# Altium schematic sheet Test1.SchDoc: EBM-A7157
size A4; CheckedBy: Colin Zhang; Author: Colin Zhang; CompanyName: Hisense; DrawnBy: Colin Zhang; Engineer: Colin Zhang; Organization: Hisense
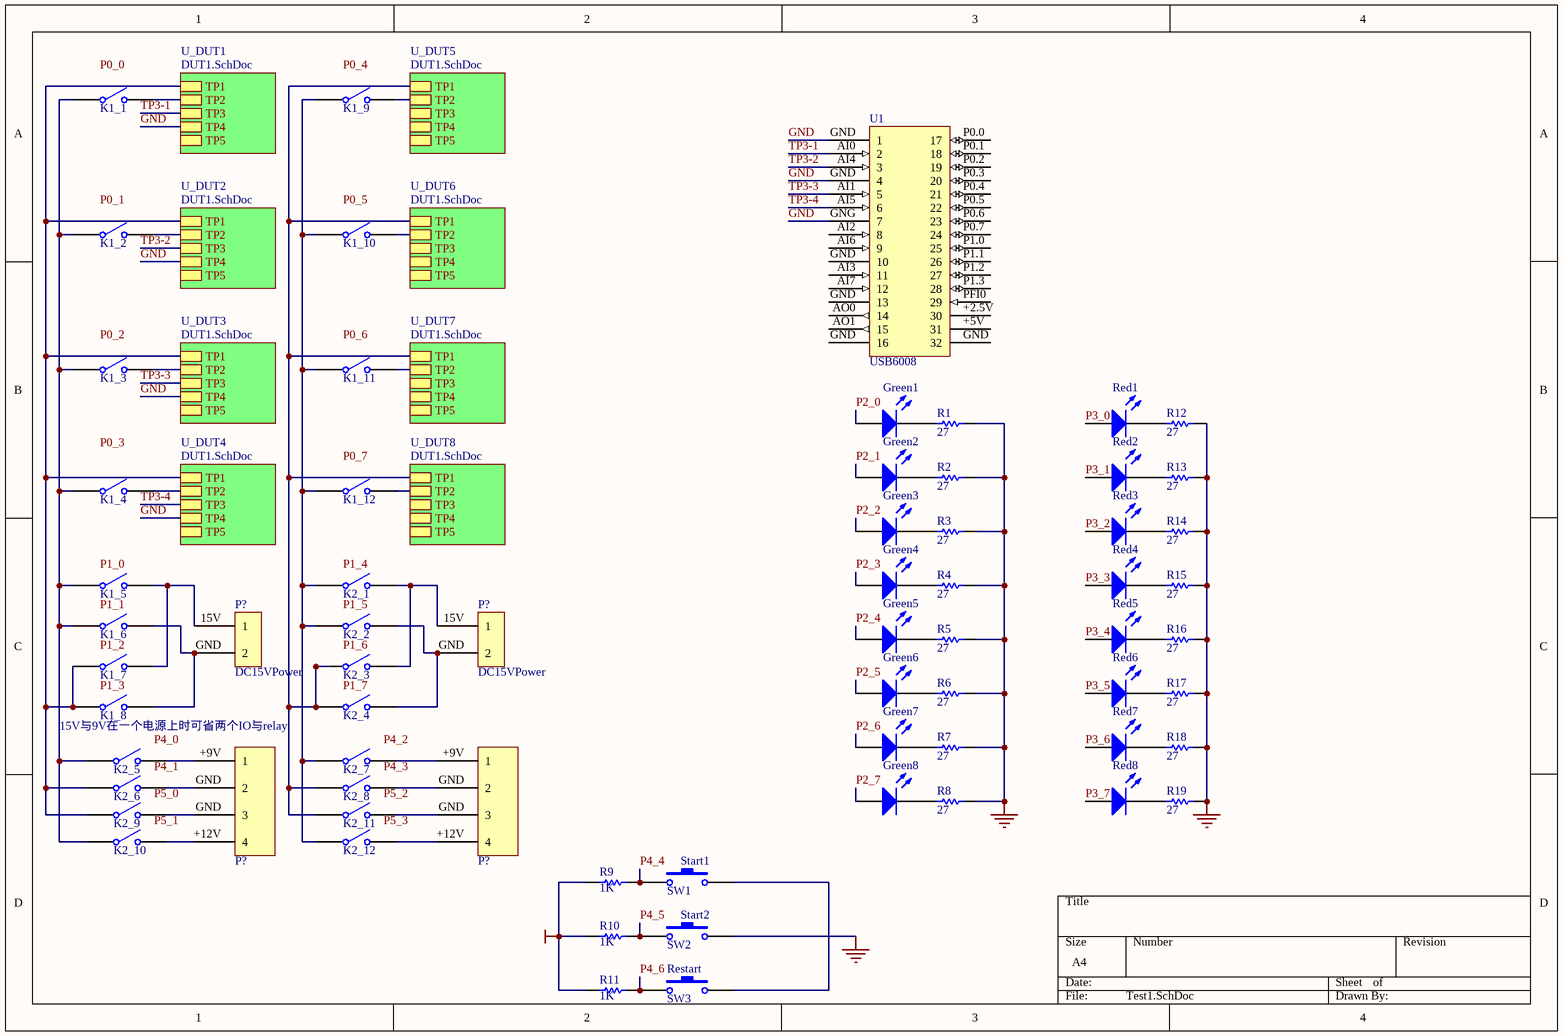
[diagram p0: Test1.SchDoc]

## Parts
(Parts that share a designator on the sheet are numbered #1, #2 ... from top to bottom, then left to right.)
Green1  LED0  [LED-0]  (value not drawn)
Green2  LED0  [LED-0]  (value not drawn)
Green3  LED0  [LED-0]  (value not drawn)
Green4  LED0  [LED-0]  (value not drawn)
Green5  LED0  [LED-0]  (value not drawn)
Green6  LED0  [LED-0]  (value not drawn)
Green7  LED0  [LED-0]  (value not drawn)
Green8  LED0  [LED-0]  (value not drawn)
K1_1  SW-SPST  [SPST-2]  (value not drawn)
K1_2  SW-SPST  [SPST-2]  (value not drawn)
K1_3  SW-SPST  [SPST-2]  (value not drawn)
K1_4  SW-SPST  [SPST-2]  (value not drawn)
K1_5  SW-SPST  [SPST-2]  (value not drawn)
K1_6  SW-SPST  [SPST-2]  (value not drawn)
K1_7  SW-SPST  [SPST-2]  (value not drawn)
K1_8  SW-SPST  [SPST-2]  (value not drawn)
K1_9  SW-SPST  [SPST-2]  (value not drawn)
K1_10  SW-SPST  [SPST-2]  (value not drawn)
K1_11  SW-SPST  [SPST-2]  (value not drawn)
K1_12  SW-SPST  [SPST-2]  (value not drawn)
K2_1  SW-SPST  [SPST-2]  (value not drawn)
K2_2  SW-SPST  [SPST-2]  (value not drawn)
K2_3  SW-SPST  [SPST-2]  (value not drawn)
K2_4  SW-SPST  [SPST-2]  (value not drawn)
K2_5  SW-SPST  [SPST-2]  (value not drawn)
K2_6  SW-SPST  [SPST-2]  (value not drawn)
K2_7  SW-SPST  [SPST-2]  (value not drawn)
K2_8  SW-SPST  [SPST-2]  (value not drawn)
K2_9  SW-SPST  [SPST-2]  (value not drawn)
K2_10  SW-SPST  [SPST-2]  (value not drawn)
K2_11  SW-SPST  [SPST-2]  (value not drawn)
K2_12  SW-SPST  [SPST-2]  (value not drawn)
P?#1  DC15VPower
P?#2  DC15VPower
P?#3  DC9V  (value not drawn)
P?#4  DC9V  (value not drawn)
R1  value 27  [AXIAL-0.3]  (hidden comment: Res1)
R2  value 27  [AXIAL-0.3]  (hidden comment: Res1)
R3  value 27  [AXIAL-0.3]  (hidden comment: Res1)
R4  value 27  [AXIAL-0.3]  (hidden comment: Res1)
R5  value 27  [AXIAL-0.3]  (hidden comment: Res1)
R6  value 27  [AXIAL-0.3]  (hidden comment: Res1)
R7  value 27  [AXIAL-0.3]  (hidden comment: Res1)
R8  value 27  [AXIAL-0.3]  (hidden comment: Res1)
R9  value 1K  [AXIAL-0.3]  (hidden comment: Res1)
R10  value 1K  [AXIAL-0.3]  (hidden comment: Res1)
R11  value 1K  [AXIAL-0.3]  (hidden comment: Res1)
R12  value 27  [AXIAL-0.3]  (hidden comment: Res1)
R13  value 27  [AXIAL-0.3]  (hidden comment: Res1)
R14  value 27  [AXIAL-0.3]  (hidden comment: Res1)
R15  value 27  [AXIAL-0.3]  (hidden comment: Res1)
R16  value 27  [AXIAL-0.3]  (hidden comment: Res1)
R17  value 27  [AXIAL-0.3]  (hidden comment: Res1)
R18  value 27  [AXIAL-0.3]  (hidden comment: Res1)
R19  value 27  [AXIAL-0.3]  (hidden comment: Res1)
Red1  LED0  [LED-0]  (value not drawn)
Red2  LED0  [LED-0]  (value not drawn)
Red3  LED0  [LED-0]  (value not drawn)
Red4  LED0  [LED-0]  (value not drawn)
Red5  LED0  [LED-0]  (value not drawn)
Red6  LED0  [LED-0]  (value not drawn)
Red7  LED0  [LED-0]  (value not drawn)
Red8  LED0  [LED-0]  (value not drawn)
SW1  Start1  [SPST-2]
SW2  Start2  [SPST-2]
SW3  Restart  [SPST-2]
U1  USB6008

## Sub-sheets
U_DUT1 = DUT1.SchDoc: TP1, TP2, TP3, TP4, TP5
U_DUT2 = DUT1.SchDoc: TP1, TP2, TP3, TP4, TP5
U_DUT3 = DUT1.SchDoc: TP1, TP2, TP3, TP4, TP5
U_DUT4 = DUT1.SchDoc: TP1, TP2, TP3, TP4, TP5
U_DUT5 = DUT1.SchDoc: TP1, TP2, TP3, TP4, TP5
U_DUT6 = DUT1.SchDoc: TP1, TP2, TP3, TP4, TP5
U_DUT7 = DUT1.SchDoc: TP1, TP2, TP3, TP4, TP5
U_DUT8 = DUT1.SchDoc: TP1, TP2, TP3, TP4, TP5

## Nets
+5V: R9.1 R10.1 R11.1
GND: R1.2 R2.2 R3.2 R4.2 R5.2 R6.2 R7.2 R8.2 R12.2 R13.2 R14.2 R15.2 R16.2 R17.2 R18.2 R19.2 SW2.2 U1.GND(1) U1.GNG(7) ; sheet U_DUT1/TP4, sheet U_DUT2/TP4, sheet U_DUT3/TP4, sheet U_DUT4/TP4
P2_0: Green1.1(A)
P2_1: Green2.1(A)
P2_2: Green3.1(A)
P2_3: Green4.1(A)
P2_4: Green5.1(A)
P2_5: Green6.1(A)
P2_6: Green7.1(A)
P2_7: Green8.1(A)
P3_0: Red1.1(A)
P3_1: Red2.1(A)
P3_2: Red3.1(A)
P3_3: Red4.1(A)
P3_4: Red5.1(A)
P3_5: Red6.1(A)
P3_6: Red7.1(A)
P3_7: Red8.1(A)
P4_4: R9.2 SW1.1
P4_5: R10.2 SW2.1
P4_6: R11.2 SW3.1
TP3-1: U1.AI0(2) ; sheet U_DUT1/TP3
TP3-2: U1.AI4(3) ; sheet U_DUT2/TP3
TP3-3: U1.AI1(5) ; sheet U_DUT3/TP3
TP3-4: U1.AI5(6) ; sheet U_DUT4/TP3
NetGreen1_2: Green1.2(K) R1.1
NetGreen2_2: Green2.2(K) R2.1
NetGreen3_2: Green3.2(K) R3.1
NetGreen4_2: Green4.2(K) R4.1
NetGreen5_2: Green5.2(K) R5.1
NetGreen6_2: Green6.2(K) R6.1
NetGreen7_2: Green7.2(K) R7.1
NetGreen8_2: Green8.2(K) R8.1
NetK1_1_1: K1_1.1(COMMON) K1_2.1(COMMON) K1_3.1(COMMON) K1_4.1(COMMON) K1_5.1(COMMON) K1_6.1(COMMON) K2_5.1(COMMON) K2_10.1(COMMON)
NetK1_1_2: K1_1.2(NO) ; sheet U_DUT1/TP2
NetK1_2_2: K1_2.2(NO) ; sheet U_DUT2/TP2
NetK1_3_2: K1_3.2(NO) ; sheet U_DUT3/TP2
NetK1_4_2: K1_4.2(NO) ; sheet U_DUT4/TP2
NetK1_5_2: K1_5.2(NO) K1_7.2(NO) P?#1.15V(1)
NetK1_6_2: K1_6.2(NO) K1_8.2(NO) P?#1.GND(2)
NetK1_7_1: K1_7.1(COMMON) K1_8.1(COMMON) K2_6.1(COMMON) K2_9.1(COMMON) ; sheet U_DUT1/TP1, sheet U_DUT2/TP1, sheet U_DUT3/TP1, sheet U_DUT4/TP1
NetK1_9_1: K1_9.1(COMMON) K1_10.1(COMMON) K1_11.1(COMMON) K1_12.1(COMMON) K2_1.1(COMMON) K2_2.1(COMMON) K2_7.1(COMMON) K2_12.1(COMMON)
NetK1_9_2: K1_9.2(NO) ; sheet U_DUT5/TP2
NetK1_10_2: K1_10.2(NO) ; sheet U_DUT6/TP2
NetK1_11_2: K1_11.2(NO) ; sheet U_DUT7/TP2
NetK1_12_2: K1_12.2(NO) ; sheet U_DUT8/TP2
NetK2_1_2: K2_1.2(NO) K2_3.2(NO) P?#2.15V(1)
NetK2_2_2: K2_2.2(NO) K2_4.2(NO) P?#2.GND(2)
NetK2_3_1: K2_3.1(COMMON) K2_4.1(COMMON) K2_8.1(COMMON) K2_11.1(COMMON) ; sheet U_DUT5/TP1, sheet U_DUT6/TP1, sheet U_DUT7/TP1, sheet U_DUT8/TP1
NetK2_5_2: K2_5.2(NO) P?#3.+9V(1)
NetK2_6_2: K2_6.2(NO) P?#3.GND(2)
NetK2_7_2: K2_7.2(NO) P?#4.+9V(1)
NetK2_8_2: K2_8.2(NO) P?#4.GND(2)
NetK2_9_2: K2_9.2(NO) P?#3.GND(3)
NetK2_10_2: K2_10.2(NO) P?#3.+12V(4)
NetK2_11_2: K2_11.2(NO) P?#4.GND(3)
NetK2_12_2: K2_12.2(NO) P?#4.+12V(4)
NetR12_1: R12.1 Red1.2(K)
NetR13_1: R13.1 Red2.2(K)
NetR14_1: R14.1 Red3.2(K)
NetR15_1: R15.1 Red4.2(K)
NetR16_1: R16.1 Red5.2(K)
NetR17_1: R17.1 Red6.2(K)
NetR18_1: R18.1 Red7.2(K)
NetR19_1: R19.1 Red8.2(K)
NetSW1_2: SW1.2 SW3.2

Not connected (* = marked no-connect by the designer): U1 +2.5V(30) +5V(31) AI2(8) AI3(11) AI6(9) AI7(12) AO0(14) AO1(15) P0.0(17) P0.1(18) P0.2(19) P0.3(20) P0.4(21) P0.5(22) P0.6(23) P0.7(24) P1.0(25) P1.1(26) P1.2(27) P1.3(28) PFI0(29)

## Notes on the sheet
- (near K1_8) 15V与9V在一个电源上时可省两个IO与relay
- Labels drawn without touching a wire or pin: P0_0, P0_1, P0_2, P0_3, P0_4, P0_5, P0_6, P0_7, P1_0, P1_1, P1_2, P1_3, P1_4, P1_5, P1_6, P1_7, P4_0, P4_1, P4_2, P4_3, P5_0, P5_1, P5_2, P5_3

## Library data of the parts
Green1-Green8 Red1-Red8 = LED0: Typical INFRARED GaAs LED; Published: 8-Jun-2000; Revision: July-2002: Re-released for DXP Platform.; Publisher: Altium Limited
K1_1-K1_12 K2_1-K2_12 = SW-SPST: Single-Pole, Single-Throw Switch; Published: 24-Mar-1999; Revision: July-2002: Re-released for DXP Platform.; Publisher: Altium Limited
R1-R19 = Res1: Resistor; Published: 8-Jun-2000; Revision: July-2002: Re-released for DXP Platform.; Publisher: Altium Limited
SW1-SW3 = SW-PB: Switch; Published: 24-Mar-1999; Revision: July-2002: Re-released for DXP Platform.; Publisher: Altium Limited